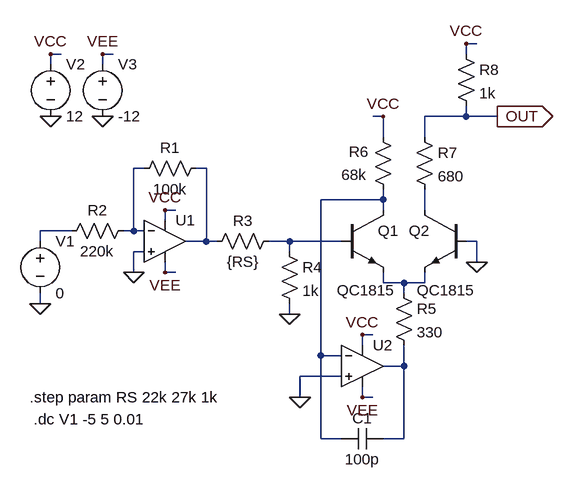
[diagram p0: schematic Antilog_NPNO_for_TLF01_V2_RevA.asc]
Antilog_NPNO_for_TLF01_V2_RevA.asc, the LTspice schematic file:
Version 4
SHEET 1 972 680
WIRE 832 -160 816 -160
WIRE 192 -144 176 -144
WIRE 272 -144 256 -144
WIRE 816 -144 816 -160
WIRE 176 -128 176 -144
WIRE 256 -128 256 -144
WIRE 688 -48 672 -48
WIRE 816 -48 816 -64
WIRE 816 -48 752 -48
WIRE 864 -48 816 -48
WIRE 688 -16 688 -48
WIRE 752 -16 752 -48
WIRE 320 32 304 32
WIRE 416 32 400 32
WIRE 688 80 688 64
WIRE 688 80 592 80
WIRE 368 96 352 96
WIRE 688 96 688 80
WIRE 752 96 752 64
WIRE 352 112 352 96
WIRE 208 128 160 128
WIRE 304 128 304 32
WIRE 304 128 288 128
WIRE 320 128 304 128
WIRE 160 144 160 128
WIRE 416 144 416 32
WIRE 416 144 384 144
WIRE 432 144 416 144
WIRE 544 144 512 144
WIRE 624 144 544 144
WIRE 832 144 816 144
WIRE 320 160 304 160
WIRE 544 160 544 144
WIRE 832 176 832 144
WIRE 304 192 304 160
WIRE 352 192 352 176
WIRE 368 192 352 192
WIRE 688 208 688 192
WIRE 720 208 688 208
WIRE 752 208 752 192
WIRE 752 208 720 208
WIRE 720 224 720 208
WIRE 160 240 160 224
WIRE 544 256 544 240
WIRE 672 288 656 288
WIRE 656 304 656 288
WIRE 592 320 592 80
WIRE 624 320 592 320
WIRE 720 336 720 304
WIRE 720 336 688 336
WIRE 624 352 560 352
WIRE 560 384 560 352
WIRE 656 384 656 368
WIRE 672 384 656 384
WIRE 592 448 592 320
WIRE 624 448 592 448
WIRE 720 448 720 336
WIRE 720 448 688 448
FLAG 304 192 0
FLAG 352 96 VCC
FLAG 352 192 VEE
FLAG 160 240 0
FLAG 544 256 0
FLAG 656 384 VEE
FLAG 656 288 VCC
FLAG 832 176 0
FLAG 560 384 0
FLAG 688 -48 VCC
FLAG 816 -160 VCC
FLAG 864 -48 OUT
IOPIN 864 -48 Out
FLAG 176 -48 0
FLAG 256 -48 0
FLAG 176 -144 VCC
FLAG 256 -144 VEE
SYMBOL voltage 160 128 R0
WINDOW 123 0 0 Left 0
WINDOW 39 0 0 Left 0
SYMATTR InstName V1
SYMATTR Value 0
SYMBOL Opamps\\UniversalOpamp2 352 144 R0
SYMATTR InstName U1
SYMBOL res 416 16 R90
WINDOW 0 0 56 VBottom 2
WINDOW 3 32 56 VTop 2
SYMATTR InstName R1
SYMATTR Value 100k
SYMBOL res 304 112 R90
WINDOW 0 0 56 VBottom 2
WINDOW 3 32 56 VTop 2
SYMATTR InstName R2
SYMATTR Value 220k
SYMBOL res 528 128 R90
WINDOW 0 0 56 VBottom 2
WINDOW 3 32 56 VTop 2
SYMATTR InstName R3
SYMATTR Value {RS}
SYMBOL res 528 144 R0
SYMATTR InstName R4
SYMATTR Value 1k
SYMBOL npn 624 96 R0
WINDOW 3 -7 123 Left 2
SYMATTR InstName Q1
SYMATTR Value QC1815
SYMBOL npn 816 96 M0
WINDOW 3 -14 123 Left 2
SYMATTR InstName Q2
SYMATTR Value QC1815
SYMBOL res 704 208 R0
SYMATTR InstName R5
SYMATTR Value 330
SYMBOL Opamps\\UniversalOpamp2 656 336 R0
SYMATTR InstName U2
SYMBOL cap 688 432 R90
WINDOW 0 0 32 VBottom 2
WINDOW 3 32 32 VTop 2
SYMATTR InstName C1
SYMATTR Value 100p
SYMBOL res 672 -32 R0
WINDOW 0 -37 38 Left 2
WINDOW 3 -48 74 Left 2
SYMATTR InstName R6
SYMATTR Value 68k
SYMBOL res 736 -32 R0
SYMATTR InstName R7
SYMATTR Value 680
SYMBOL res 800 -160 R0
SYMATTR InstName R8
SYMATTR Value 1k
SYMBOL voltage 176 -144 R0
WINDOW 123 0 0 Left 0
WINDOW 39 0 0 Left 0
SYMATTR InstName V2
SYMATTR Value 12
SYMBOL voltage 256 -144 R0
WINDOW 123 0 0 Left 0
WINDOW 39 0 0 Left 0
SYMATTR InstName V3
SYMATTR Value -12
TEXT 144 384 Left 2 !.step param RS 22k 27k 1k
TEXT 150 418 Left 2 !.dc V1 -5 5 0.01

The netlist it stands for:
* Antilog_NPNO_for_TLF01_V2_RevA.asc
V1 N005 0 0
XU1 0 N001 VCC VEE N002 level.2 Avol=1Meg GBW=10Meg Slew=10Meg ilimit=25m rail=0 Vos=0 phimargin=45 en=0 enk=0 in=0 ink=0 Rin=500Meg  ; pins IN+ IN- V+ V- OUT
R1 N002 N001 100k
R2 N001 N005 220k
R3 N006 N002 {RS}
R4 N006 0 1k
Q1 N003 N006 N007 0 QC1815
Q2 N004 0 N007 0 QC1815
R5 N007 N008 330
XU2 0 N003 VCC VEE N008 level.2 Avol=1Meg GBW=10Meg Slew=10Meg ilimit=25m rail=0 Vos=0 phimargin=45 en=0 enk=0 in=0 ink=0 Rin=500Meg  ; pins IN+ IN- V+ V- OUT
C1 N008 N003 100p
R6 VCC N003 68k
R7 OUT N004 680
R8 VCC OUT 1k
V2 VCC 0 12
V3 VEE 0 -12
.model NPN NPN
.model PNP PNP
.lib standard.bjt
.step param RS 22k 27k 1k
.dc V1 -5 5 0.01
.lib UniversalOpamps2.sub
.backanno
.end